# Altium project TRON25_LEDPATCH.PrjPcb
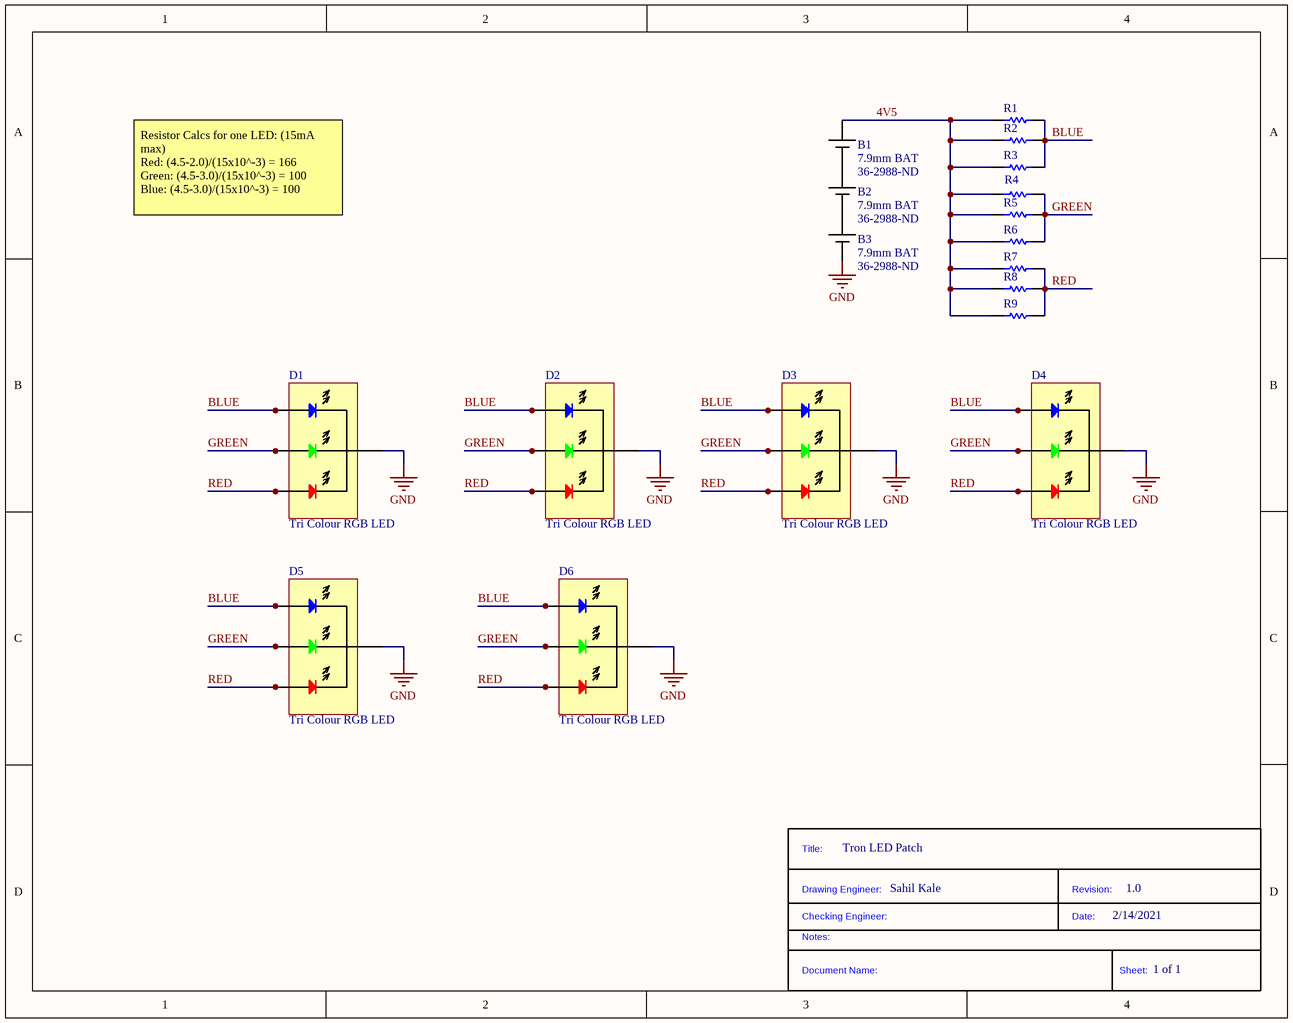
[diagram p0: Main.SchDoc]
1 sheet, 19 parts. Net scope: global (net labels, ports and power ports of the same name join across sheets).
Board files: Patch.PcbDoc, Patch65mm.PcbDoc

## Sheet Main.SchDoc: LED Patch Schematic
size A; DrawnBy: Sahil Kale; Revision: 1.0; SheetNumber: 1; SheetTotal: 1

### Parts
*  TitleBlock  (value not drawn)  (graphical)
B1  7.9mm BAT  Supplier Part Number 1: 36-2988-ND  [2988]
B2  7.9mm BAT  Supplier Part Number 1: 36-2988-ND  [2988]
B3  7.9mm BAT  Supplier Part Number 1: 36-2988-ND  [2988]
D1  Tri Colour RGB LED  [RGB_LED_THRUHOLE]
D2  Tri Colour RGB LED  [RGB_LED_THRUHOLE]
D3  Tri Colour RGB LED  [RGB_LED_THRUHOLE]
D4  Tri Colour RGB LED  [RGB_LED_THRUHOLE]
D5  Tri Colour RGB LED  [RGB_LED_THRUHOLE]
D6  Tri Colour RGB LED  [RGB_LED_THRUHOLE]
R1  ?Ω  [Generic ThroughHole]  (value not drawn)
R2  ?Ω  [Generic ThroughHole]  (value not drawn)
R3  ?Ω  [Generic ThroughHole]  (value not drawn)
R4  ?Ω  [Generic ThroughHole]  (value not drawn)
R5  ?Ω  [Generic ThroughHole]  (value not drawn)
R6  ?Ω  [Generic ThroughHole]  (value not drawn)
R7  ?Ω  [Generic ThroughHole]  (value not drawn)
R8  ?Ω  [Generic ThroughHole]  (value not drawn)
R9  ?Ω  [Generic ThroughHole]  (value not drawn)

### Nets
GND: B3.1(-) D1.4(GND) D2.4(GND) D3.4(GND) D4.4(GND) D5.4(GND) D6.4(GND)
4V5: B1.2(+) R1.1 R2.1 R3.1 R4.1 R5.1 R6.1 R7.1 R8.1 R9.1
BLUE: D1.3(Blue_+) D1.6(Blue_+) D2.3(Blue_+) D2.6(Blue_+) D3.3(Blue_+) D3.6(Blue_+) D4.3(Blue_+) D4.6(Blue_+) D5.3(Blue_+) D5.6(Blue_+) D6.3(Blue_+) D6.6(Blue_+) R1.2 R2.2 R3.2
GREEN: D1.2(Green_+) D2.2(Green_+) D3.2(Green_+) D4.2(Green_+) D5.2(Green_+) D6.2(Green_+) R4.2 R5.2 R6.2
RED: D1.1(Red_+) D1.4(Red_+) D2.1(Red_+) D2.4(Red_+) D3.1(Red_+) D3.4(Red_+) D4.1(Red_+) D4.4(Red_+) D5.1(Red_+) D5.4(Red_+) D6.1(Red_+) D6.4(Red_+) R7.2 R8.2 R9.2
NetB1_1: B1.1(-) B2.2(+)
NetB2_1: B2.1(-) B3.2(+)

### Notes on the sheet
- Resistor Calcs for one LED: (15mA max)
  Red: (4.5-2.0)/(15x10^-3) = 166
  Green: (4.5-3.0)/(15x10^-3) = 100
  Blue: (4.5-3.0)/(15x10^-3) = 100
- Tron LED Patch
- Sahil Kale
- 1.0
- 2/14/2021
- 1 of 1
- (in symbol TitleBlock) Title:; Drawing Engineer:; Revision:; Checking Engineer:; Date:; Notes:; Document Name:; Sheet:

### Library data of the parts
* = TitleBlock: Standard Title Block
B1-B3 = CCELL HOLDER 7.9MM: KEYSTONE         2988            BATTERY CONTACT, 7.9MM HEAR AID CELL, SURFACE MT; Manufacturer: Keystone Electronics; Supplier 1: Digi-Key; Manufacturer Part Number: 2988; RoHS: Yes; Category: Batteries and Accessories; Stock 1: 1523; Pricing 1: 1=0.39000, 25=0.35440, 100=0.34690, 250=0.32528, 500=0.28920 (USD); ComponentLink1URL: https://datasheet.ciiva.com/4642/m60p6-29374-4642672.pdf?src-supplier=Mouser; ComponentLink1Description: https://datasheet.ciiva.com/4642/m60p6-29374-4642672.pdf?src-supplier=Mouser; ComponentLink2URL: https://datasheet.ciiva.com/4/2988-4524.pdf?src-supplier=Digi-Key; ComponentLink2Description: https://datasheet.ciiva.com/4/2988-4524.pdf?src-supplier=Digi-Key; ComponentLink3URL: https://datasheet.ciiva.com/1390/1726104-1390366.pdf?src-supplier=Element14; ComponentLink3Description: https://datasheet.ciiva.com/1390/1726104-1390366.pdf?src-supplier=Element14
D1-D6 = LED_RGB_THRUHOLE: Supplier Link: https://www.amazon.com/Tricolor-Multicolor-Lighting-Electronics-Components/dp/B01C19ENDM
R1-R9 = GENERIC - RES: Generic Through Hole Resistor